# EAGLE design LOXpixel (EAGLE 9.5.1)
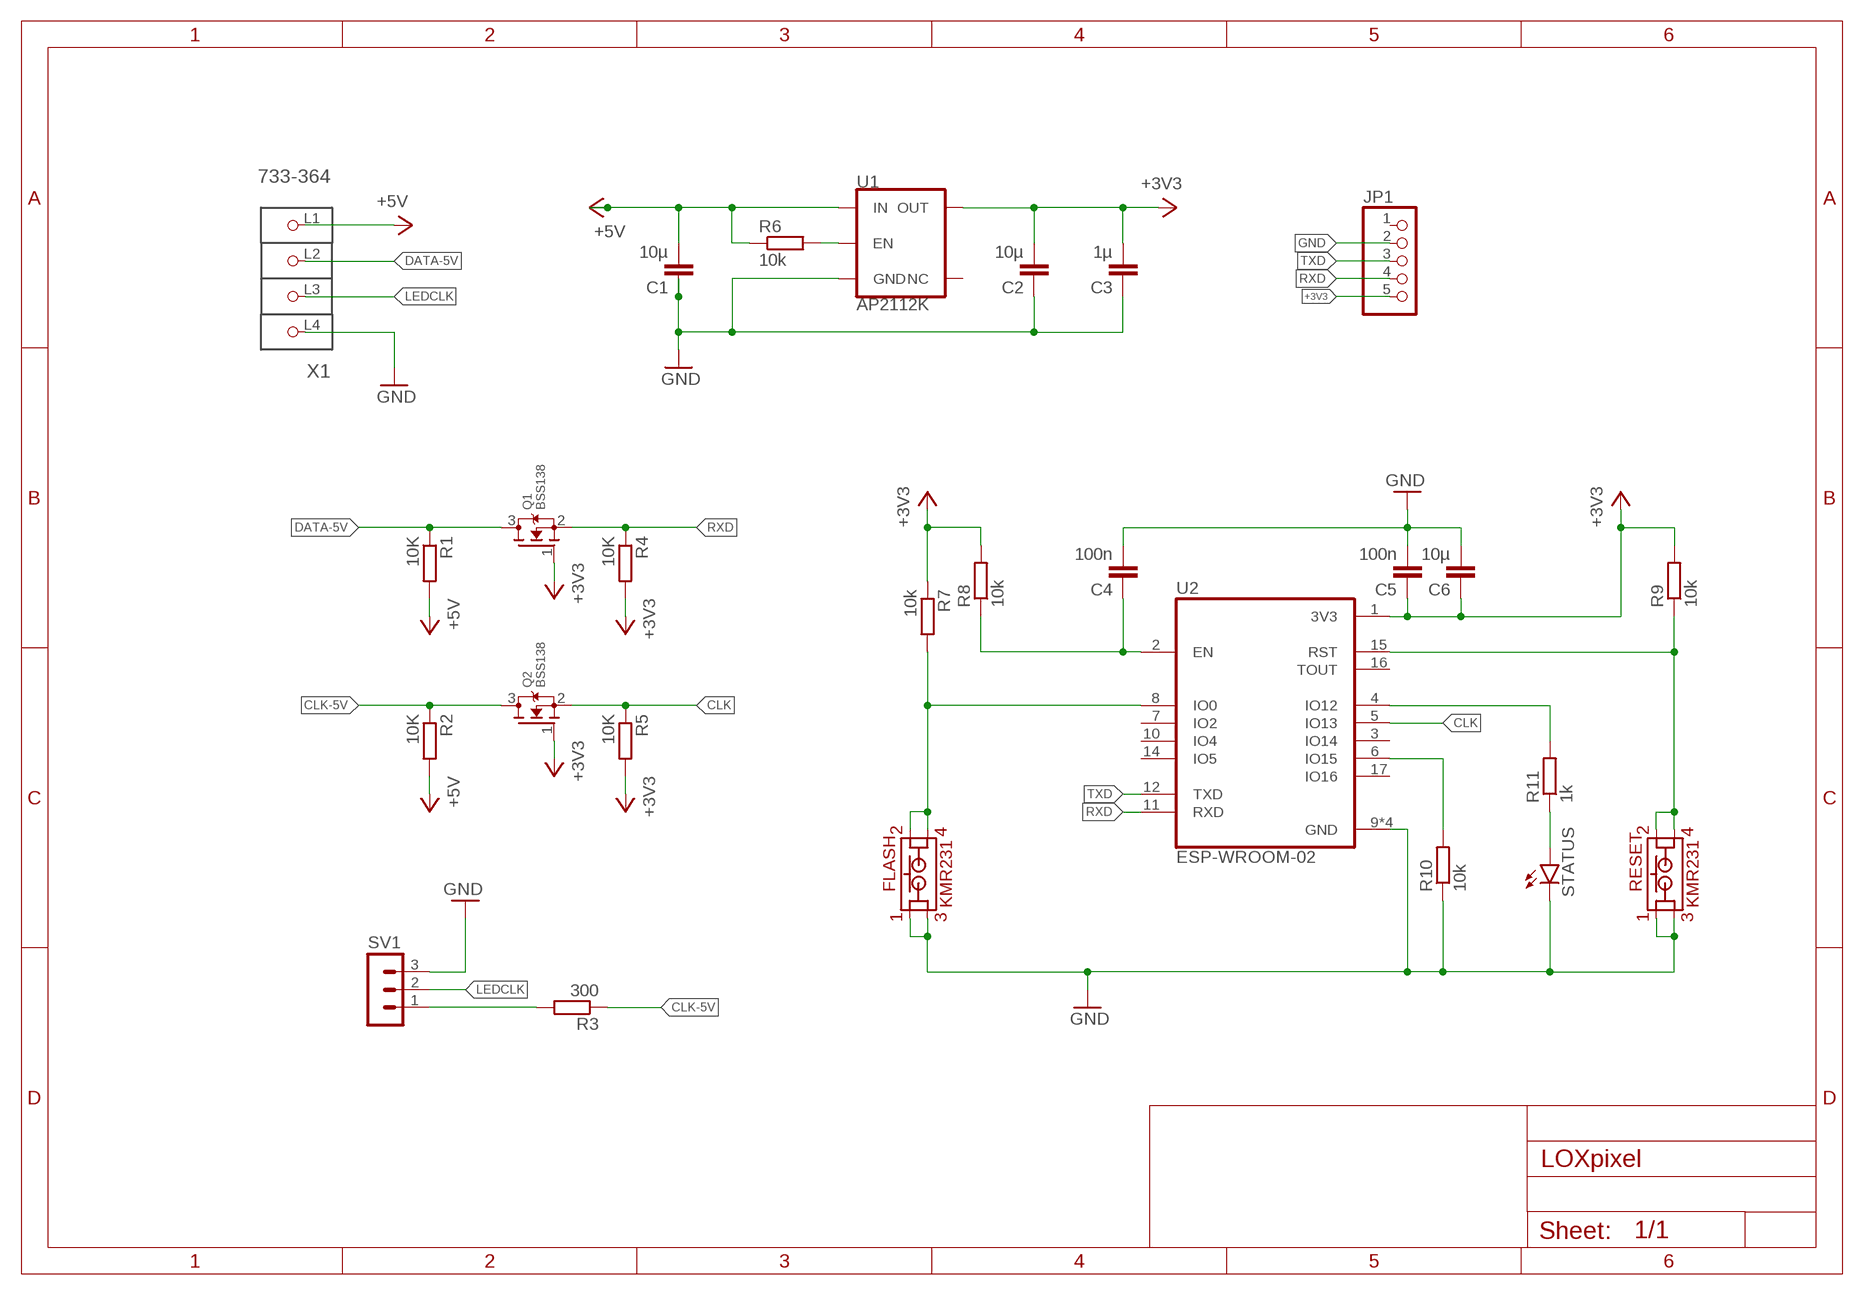
[diagram p0: schematic, sheet 1]

## Parts
C1  10µ  C-EUC0805  [C0805]
C2  10µ  C-EUC0805  [C0805]
C3  1µ  C-EUC0805  [C0805]
C4  100n  C-EUC0805  [C0805]
C5  100n  C-EUC0805  [C0805]
C6  10µ  C-EUC0805  [C0805]
FLASH  KMR231  [GLFS]
JP1  PINHD-1X5  [1X05]
Q1  BSS138  MOSFET-NREFLOW  [SOT23]
Q2  BSS138  MOSFET-NREFLOW  [SOT23]
R1  10K  R-EU_R0805  [R0805]
R2  10K  R-EU_R0805  [R0805]
R3  300  R-EU_R0805  [R0805]
R4  10K  R-EU_R0805  [R0805]
R5  10K  R-EU_R0805  [R0805]
R6  10k  R-EU_R0805  [R0805]
R7  10k  R-EU_R0805  [R0805]
R8  10k  R-EU_R0805  [R0805]
R9  10k  R-EU_R0805  [R0805]
R10  10k  R-EU_R0805  [R0805]
R11  1k  R-EU_R0805  [R0805]
RESET  KMR231  [GLFS]
STATUS  LEDCHIPLED_0805  [CHIPLED_0805]
SV1  MA03-1  [MA03-1]
U1  AP2112K  V_REG_AP2112K-3.3V  [SOT23-5]
U2  ESP-WROOM-02  [MODULE_ESP-WROOM-02]
X1  733-364  [P-733-364]

## Nets
+3V3: C2.2 C3.2 C5.1 C6.1 JP1.5 Q1.1(G) Q2.1(G) R4.2 R5.2 R7.1 R8.2 R9.2 U1.5(OUT) U2.1(3V3)
+5V: C1.2 R1.2 R2.2 R6.1 U1.1(IN) X1.L1(P1)
BOOTMODE: R10.2 U2.6(IO15)
CHIPEN: C4.1 R8.1 U2.2(EN)
CLK: Q2.2(S) R5.1 U2.5(IO13)
CLK-5V: Q2.3(D) R2.1 R3.1
DATA-5V: Q1.3(D) R1.1 X1.L2(P2)
FLASH: FLASH.P$2 FLASH.P$4 R7.2 U2.8(IO0)
GND: C1.1 C2.1 C3.1 C4.2 C5.2 C6.2 FLASH.P$1 FLASH.P$3 JP1.2 R10.1 RESET.P$1 RESET.P$3 STATUS.C SV1.3 U1.2(GND) U2.9(GND) U2.13(GND) U2.18(GND) U2.19(GND) X1.L4(P4)
LEDCLK: SV1.2 X1.L3(P3)
N$1: R6.2 U1.3(EN)
N$2: R11.1 STATUS.A
N$10: R3.2 SV1.1
RST: R9.1 RESET.P$2 RESET.P$4 U2.15(RST)
RXD: JP1.4 Q1.2(S) R4.1 U2.11(RXD)
STATLED: R11.2 U2.4(IO12)
TXD: JP1.3 U2.12(TXD)
Unconnected: JP1.1 U1.4(NC) U2.3(IO14) U2.7(IO2) U2.10(IO4) U2.14(IO5) U2.16(TOUT) U2.17(IO16)

## Library data of the parts
C1-C6 = rcl:C-EU: CAPACITOR, European symbol; SPICEPREFIX: C
FLASH RESET = eagle-book:KMR231: Surface-mount Tactile Switch - Single-Pole, Single-Throw (SPST)
JP1 = pinhead:PINHD-1X5: PIN HEADER
Q1 Q2 = adafruit:MOSFET-N: N-Channel Mosfet 2N7002E - 60V 260mA SOT23 [Digikey: 2N7002ET1GOSTR-ND] - REEL BSH103 - 30V 850mA SOT23 [Digikey: 568-5013-1-ND]
R1-R11 = rcl:R-EU_: RESISTOR, European symbol; SPICEPREFIX: R
STATUS = led:LED: LED OSRAM: - CHIPLED LG R971, LG N971, LY N971, LG Q971, LY Q971, LO R971, LY R971 LH N974, LH R974 LS Q976, LO Q976, LY Q976 LO Q996 - Hyper CHIPLED LW Q18S LB Q993, LB Q99A, LB R99A - SideLED LS A670, LO A670, LY A670, LG A670, LP A670 LB A673, LV A673, LT A673, LW A673 LH A674 LY A675 LS A676, LA A676, LO A676, LY A676, LW A676 LS A679, LY A679, LG A679 - Hyper Micro SIDELED® LS Y876, LA Y876, LO Y876, LY Y876 LT Y87S - SmartLED LW L88C, LW L88S LB L89C, LB L89S, LG L890 LS L89K, LO L89K, LY L89K LS L896, LA L896, LO L896, LY L896 - TOPLED LS T670, LO T670, LY T670, LG T670, LP T670 LSG T670, LSP T670, LSY T670, LOP T670, LYG T670 LG T671, LOG T671, LSG T671 LB T673, LV T673, LT T673, LW T673 LH T674 LS T676, LA T676, LO T676, LY T676, LB T676, LH T676, LSB T676, LW T676 LB T67C, LV T67C, LT T67C, LS T67K, LO T67K, LY T67K, LW E67C LS E67B, LA E67B, LO E67B, LY E67B, LB E67C, LV E67C, LT E67C LW T67C LS T679, LY T679, LG T679 LS T770, LO T770, LY T770, LG T770, LP T770 LB T773, LV T773, LT T773, LW T773 LH T774 LS E675, LA E675, LY E675, LS T675 LS T776, LA T776, LO T776, LY T776, LB T776 LHGB T686 LT T68C, LB T68C - Hyper Mini TOPLED® LB M676 - Mini TOPLED Santana® LG M470 LS M47K, LO M47K, LY M47K Source: http://www.osram.convergy.de LUXEON: - LUMILED® LXK2-PW12-R00, LXK2-PW12-S00, LXK2-PW14-U00, LXK2-PW14-V00 LXK2-PM12-R00, LXK2-PM12-S00, LXK2-PM14-U00 LXK2-PE12-Q00, LXK2-PE12-R00, LXK2-PE12-S00, LXK2-PE14-T00, LXK2-PE14-U00 LXK2-PB12-K00, LXK2-PB12-L00, LXK2-PB12-M00, LXK2-PB14-N00, LXK2-PB14-P00, LXK2-PB14-Q00 LXK2-PR12-L00, LXK2-PR12-M00, LXK2-PR14-Q00, LXK2-PR14-R00 LXK2-PD12-Q00, LXK2-PD12-R00, LXK2-PD12-S00 LXK2-PH12-R00, LXK2-PH12-S00 LXK2-PL12-P00, LXK2-PL12-Q00, LXK2-PL12-R00 Source: www.luxeon.com KINGBRIGHT: KA-3528ASYC Source: www.kingbright.com
SV1 = con-lstb:MA03-1: PIN HEADER; OC_FARNELL: unknown; OC_NEWARK: unknown
U1 = SparkFun-IC-Power:V_REG_AP2112: AP2112 - 600mA CMOS LDO Regulator w/ Enable The AP2112 is CMOS process low dropout linear regulator with enable function, the regulator delivers a guaranteed 600mA (min.) continuous load current. Features Output Voltage Accuracy: ±1.5% Output Current: 600mA (Min.) Foldback Short Current Protection: 50mA Enable Function to Turn ON/OFF VOUT Low Dropout Voltage (3.3V): 250mV (Typ.) @IOUT=600mA Excellent Load Regulation: 0.2%/A (Typ.) Excellent Line Regulation: 0.02%/V (Typ.) Low Quiescent Current: 55μA (Typ.) Low Standby Current: 0.01μA (Typ.) Low Output Noise: 50μVRMS PSRR: 100Hz -65dB, 1kHz -65dB OTSD Protection Stable with 1.0μF Flexible Cap: Ceramic, Tantalum and Aluminum Electrolytic Operation Temperature Range: -40°C to 85°C ESD: MM 400V, HBM 4000V; PROD_ID: VREG-12457; VALUE: 3.3V
U2 = ESP-WROOM-02:ESP-WROOM-02: Wi-Fi Module w/ESP8266 802.11b/g/n 20dBm 20x18x3mm; AVAILABILITY: Unavailable; DESCRIPTION: Wi-Fi Module w/ESP8266 802.11b/g/n 20dBm 20x18x3mm; MF: Espressif Systems; MP: ESP-WROOM-02; PACKAGE: SMD-18 Espressif Systems; PRICE: None
X1 = con-wago_2.5mm:733-364: Serie 733, Stiftleiste (für Leiterplatten) Einlötstift abgewinkelt 0,8 x 0,8 mm / Series 733, Male header (for PCBs) Angled solder pin 0.8 x 0.8 mm Polzahl / Pole No.: 4 Rastermaß / Pitch: 2.5 mm Bemessungsspannung / Rated Voltage: 160 V Nennstrom / Nominal Current: 6 A Lötstiftlänge: / Solder Pin Length: 3.7 mm Farbe / Color: lichtgrau / light gray Stand: 01.01.2012. Die jeweils aktuellen Daten zu diesem Artikel finden Sie in unserem Produktkatalog, den Sie unter www.wago.com einsehen können. As of: 01/01/2012. Please find the newest data for this article in our product catalogue, which can be viewed under www.wago.com.

## Board
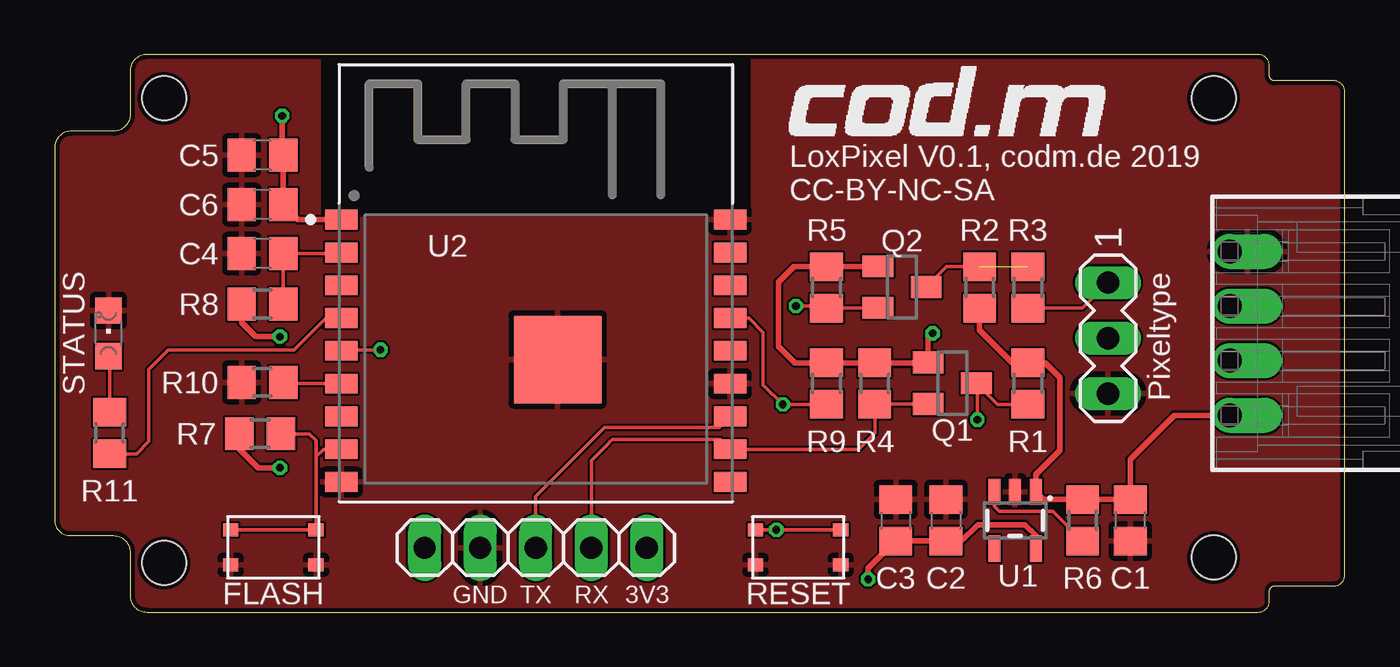
[diagram p1: board, top side]
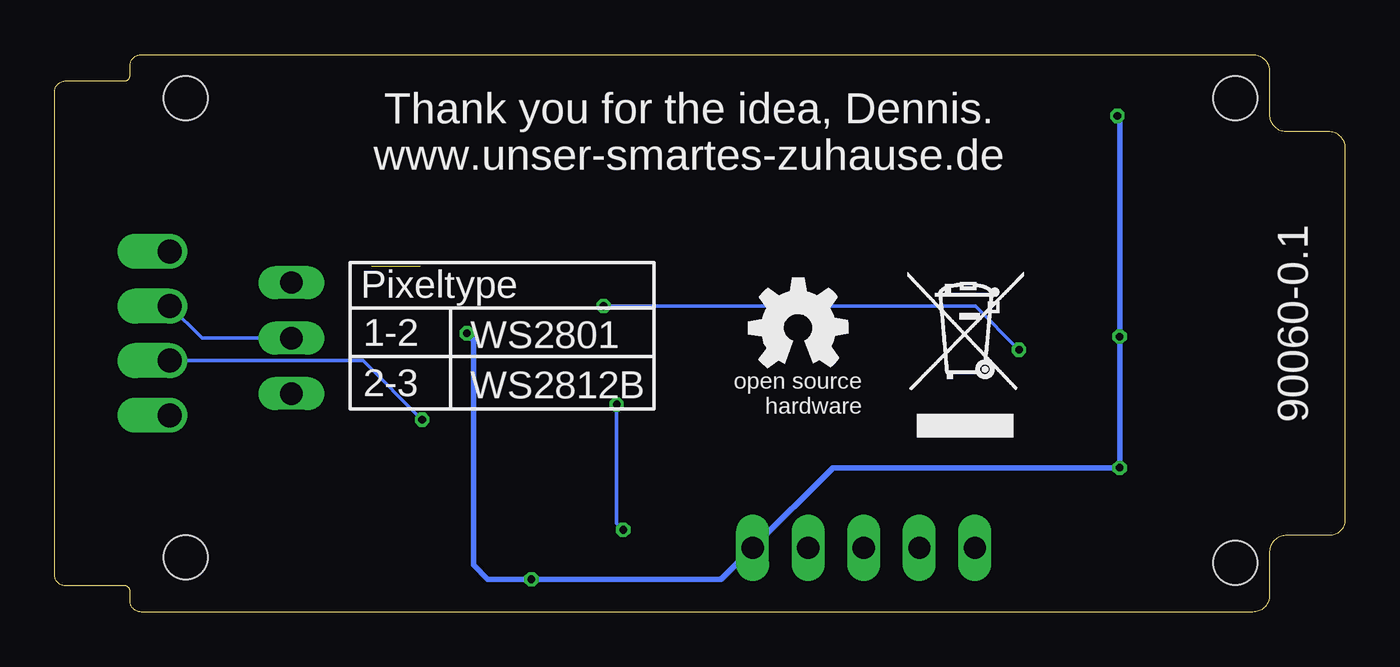
[diagram p2: board, bottom side, seen from below]

Size 59 x 25.5 mm. Coordinates in mm from the lower left corner, seen from the top.
Outline: 4.2,0 55.05,0 arc90 55.55,0.5 55.55,0.95 arc-90 55.8,1.2 58.5,1.2 arc90 59,1.7 59,23.8 arc90 58.5,24.3 55.8,24.3 arc-90 55.55,24.55 55.55,25 arc90 55.05,25.5 4.2,25.5 arc90 3.45,24.75 3.45,22.75 arc-90 2.7,22 0.75,22 arc90 0,21.25 0,4.2 arc90 0.7,3.5 2.7,3.5 arc-90 3.45,2.7 3.45,0.75 arc90 4.2,0
Copper layers (1*16): Top 0.035mm / dielectric 1.5mm / Bottom 0.035mm
Design rules "aisler_2_layer": minimum track width 0.1mm, minimum drill 0.2mm, track to track 0.1mm, track to pad 0.1mm, pad to pad 0.1mm, via to via 0.1mm, smd to smd 0.1mm, copper to edge 0.2mm, drill to drill 0.21mm, minimum pad ring 0.25mm, minimum via ring 0.15mm, stop-mask expansion 0mil, vias tented up to drill 0mil, thermal gap 10mil
Holes 2 mm at 5,2.25 5,23.5 53,23.5 53,2.5

### Footprints (pad centres in the part's own frame; a part is rotated, then mirrored left to right if it is on the bottom)
C0805 = smd 1.3 x 1.5: 1 -0.95,0; 2 0.95,0
GLFS = smd 0.7 x 0.6: P$1 1.95,0.8; P$2 1.95,-0.8; P$3 -1.95,0.8; P$4 -1.95,-0.8
1X05 = drill 1.016 long: 1 -5.08,0; 2 -2.54,0; 3 0,0; 4 2.54,0; 5 5.08,0
SOT23 = smd 1 x 1.4: 1 -0.95,-1.1; 2 0.95,-1.1; 3 0,1.1
R0805 = smd 1.3 x 1.5: 1 -0.95,0; 2 0.95,0
CHIPLED_0805 = smd 1.2 x 1.2: A 0,-1.05; C 0,1.05
MA03-1 = drill 1.016 long: 1 -2.54,0; 2 0,0; 3 2.54,0
SOT23-5 = smd 0.55 x 1.2: 1 -0.95,-1.3; 2 0,-1.3; 3 0.95,-1.3; 4 0.95,1.3; 5 -0.95,1.3
MODULE_ESP-WROOM-02 = smd 1.485 x 0.9: 1 -8.893,4.9; 2 -8.893,3.4; 3 -8.893,1.9; 4 -8.893,0.4; 5 -8.893,-1.1; 6 -8.893,-2.6; 7 -8.893,-4.1; 8 -8.893,-5.6; 9 -8.893,-7.1; 10 8.893,-7.1; 11 8.893,-5.6; 12 8.893,-4.1; 13 8.893,-2.6; 14 8.893,-1.1; 15 8.893,0.4; 16 8.893,1.9; 17 8.893,3.4; 18 8.893,4.9 | smd 4 x 4: 19 1,-1.5
P-733-364 = drill 1.1 pad 1.6 offset: L1 -3.65,-3.75; L2 -3.65,-1.25; L3 -3.65,1.25; L4 -3.65,3.75

### Placement (x,y rotation side)
C1  49.19,4.2 90 top
C2  40.76,4.2 270 top
C3  38.46,4.2 270 top
C4  9.5,16.4 180 top
C5  9.5,20.9 180 top
C6  9.5,18.64 180 top
FLASH  10,2.96 180 top
JP1  22,2.94 0 top
Q1  41.05,10.47 270 top
Q2  38.75,14.87 270 top
R1  44.5,10.45 90 top
R2  42.3,14.85 270 top
R3  44.5,14.85 270 top
R4  37.5,10.45 90 top
R5  35.3,14.85 90 top
R6  47.01,4.2 270 top
R7  9.39,8.16 0 top
R8  9.5,14.09 180 top
R9  35.29,10.45 90 top
R10  9.5,10.51 0 top
R11  2.51,8.19 270 top
RESET  34,2.96 180 top
STATUS  2.46,12.75 0 top
SV1  48.17,12.53 270 top
U1  43.92,4.2 180 top
U2  22,13.05 0 top
U$1  [CODM-LOGO]  33.6,21.8 0 top
U$2  [WEEE-LOGO-5MM]  20,8 0 bottom
U$3  [OSHW_5MM]  25,13 0 bottom
X1  57.38,12.75 0 top

### Tracks (layer width: path | path; a pad name or v marks a point on that pad's centre or on a via)
+3V3  (via drill 0.35)
  Top 0.152: R5.2 35.1,15.6
  Top 0.254: U1.5 44.87,3.5 44.37,4 42.21,4 41.46,3.25 C2.2 C3.2 37.2,1.99 v37.2,1.5 | 39.93,11.4 R4.2 R9.2 33.85,11.4 33.1,12.15 33.1,15.1 33.8,15.8 34.9,15.8 35.1,15.6 | 39.93,11.4 Q1.1 | R5.2 37.63,15.8 Q2.1 | v10.4,22.7 10.4,20.95 C5.1 C6.1 11.14,17.95 U2.1 | R7.1 8.44,7.46 9.3,6.6 v10.3,6.6 | R8.2 8.55,13.25 9.2,12.6 v10.3,12.6 | v40.15,12.75 39.93,12.53 39.93,11.4
  Bottom 0.254: v40.15,12.75 39.85,12.45 39.85,2.15 39.2,1.5 v37.2,1.5 28.52,1.5 JP1.5 23.42,6.6 v10.3,6.6 v10.3,12.6 10.3,22.6 v10.4,22.7
+5V
  Top 0.254: X1.L1 51.2,9 49.19,6.99 C1.2 R6.1 45.22,5.15 U1.1 44.87,6.3 45.97,7.4 45.97,10.73 45.3,11.4 R1.2 43.8,11.4 42.3,12.9 R2.2
BOOTMODE
  Top 0.152: U2.6 10.51,10.45 R10.2
CHIPEN
  Top 0.152: U2.2 13.06,16.4 C4.1 R8.1
CLK  (via drill 0.35)
  Top 0.152: Q2.2 35.32,13.92 R5.1 35.2,14 v33.9,14 | U2.5 13.16,12 v14.9,12
  Bottom 0.152: v14.9,12 16.9,14 v33.9,14
CLK-5V  (1 unrouted)
  Top 0.152: R2.1 40.78,15.8 Q2.3
DATA-5V  (via drill 0.35)
  Top 0.152: v42.2,8.8 42.2,10.42 Q1.3 43.12,9.5 R1.1
  Bottom 0.152: X1.L2 44.9,11.5 v42.2,8.8
FLASH
  Top 0.152: FLASH.P$2 FLASH.P$4 11.95,7.11 | R7.2 11.64,8.16 11.95,7.85 11.95,7.11 | U2.8 12.29,7.45 11.95,7.11
GND
  pour Top: 0,0 0,26 12.1,26 12.1,18 31.9,18 31.9,26 59,26 59,0
LEDCLK
  Bottom 0.152: X1.L3 52.26,12.53 SV1.2
N$1
  Top 0.152: U1.3 42.97,4.83 43.2,4.6 45.66,4.6 R6.2
N$2
  Top 0.152: R11.1 2.51,11.65 STATUS.A
N$10
  Top 0.152: R3.2 47,13.9 SV1.1
RST  (via drill 0.35)
  Top 0.152: U2.15 31.75,13.45 32.4,12.8 32.4,10.4 v33.3,9.5 R9.1 | RESET.P$2 v33,3.76 RESET.P$4
  Bottom 0.152: v33.3,9.5 33.3,4.06 v33,3.76
RXD
  Top 0.152: Q1.2 37.52,9.52 | R4.1 37.5,8.2 36.75,7.45 U2.11 30.44,7.9 25.5,7.9 25.4,7.8 25.3,7.7 24.54,6.94 JP1.4
  Top 0.2: 37.52,9.52 R4.1
STATLED
  Top 0.152: R11.2 3.74,7.24 4.3,7.8 4.3,11.1 5.2,12 10.96,12 12.41,13.45 U2.4
TXD
  Top 0.152: JP1.3 22,5.3 25.15,8.45 30.39,8.45 U2.12

### Text on the board
tNames: LoxPixel V0.1, codm.de 2019 / CC-BY-NC-SA | Pixeltype | GND | TX | RX | 3V3
bNames: Thank you for the idea, Dennis. / www.unser-smartes-zuhause.de | Pixeltype | 90060-0.1 | WS2801 | 1-2 | WS2812B | 2-3